# Altium schematic sheet 01_Power.SchDoc
size 513 x 386 mm
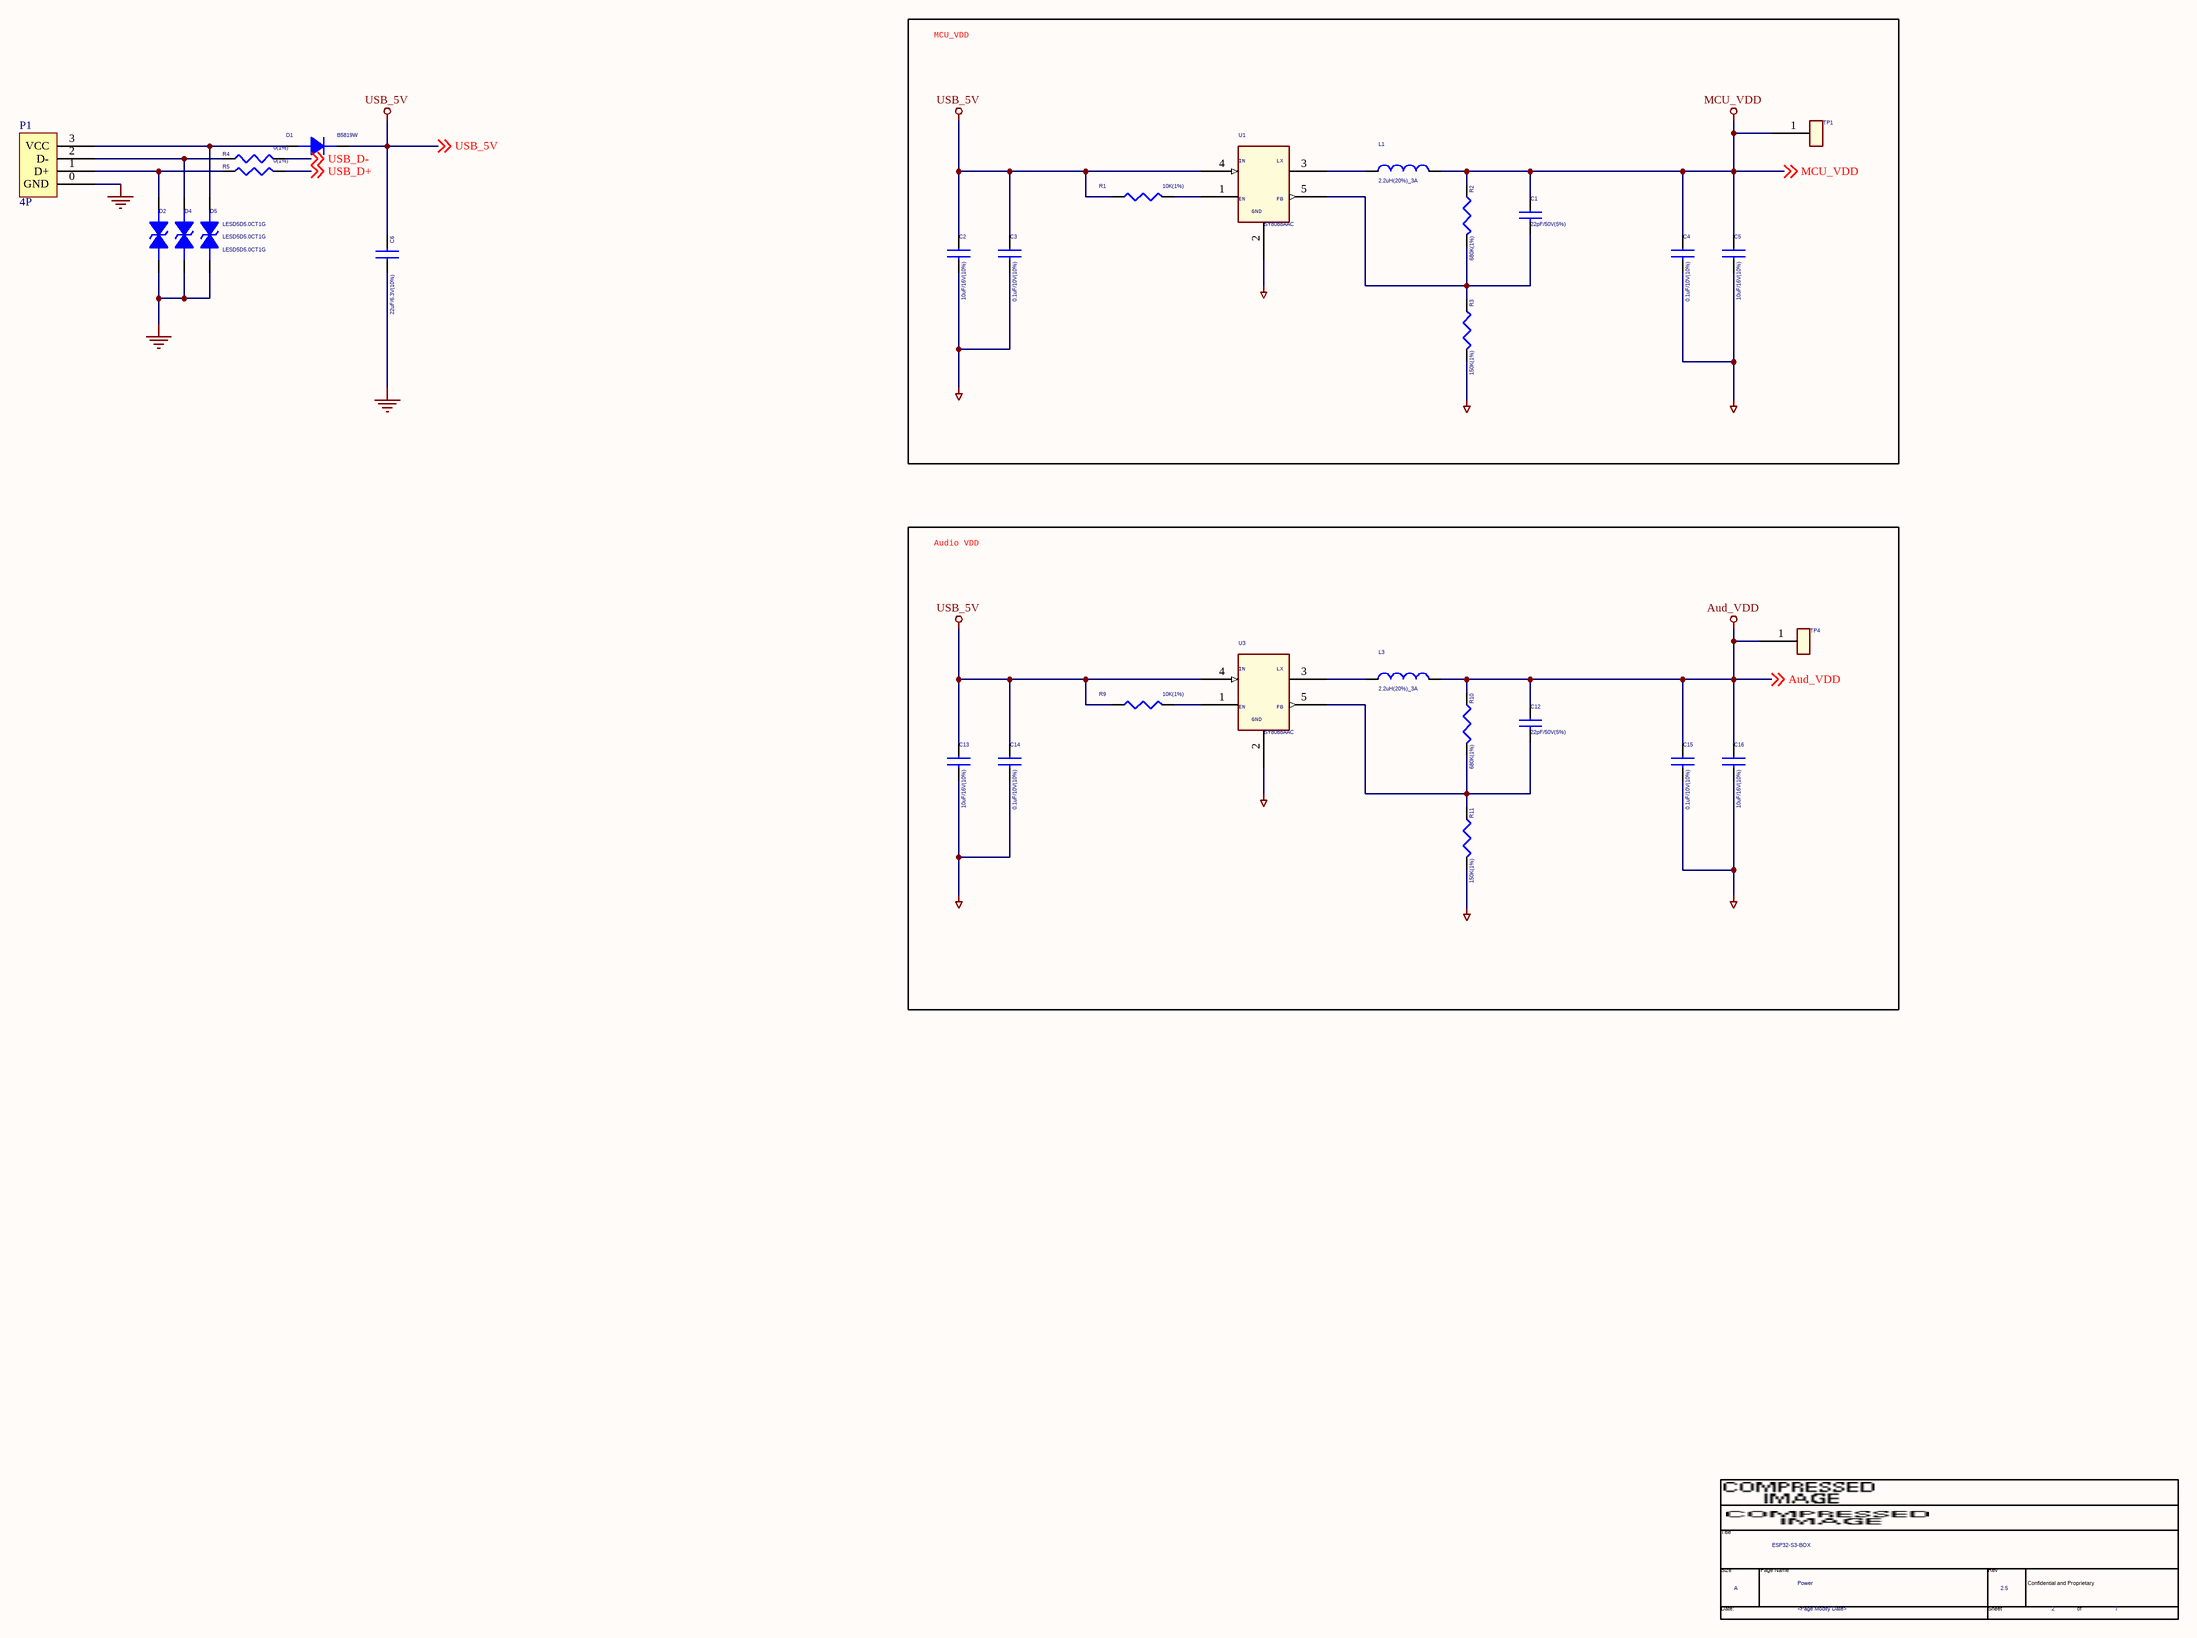
[diagram p0: 01_Power.SchDoc]

## Parts
*  Page Modify Date: <Page Modify Date>  Page Name: Power  Title: ESP32-S3-BOX  Page Size: A  Page Number: 2  Page Count: 7  RevCode: 2.5  (hidden comment: espTitleBlock3)  (graphical)
C1  22pF/50V(5%)  [0402_C]
C2  10uF/16V(10%)  [0603_C]
C3  0.1uF/10V(10%)  [0402_C]
C4  0.1uF/10V(10%)  [0402_C]
C5  10uF/16V(10%)  [0603_C]
C6  22uF/6.3V(10%)  [0603_C]
C12  22pF/50V(5%)  [0402_C]
C13  10uF/16V(10%)  [0603_C]
C14  0.1uF/10V(10%)  [0402_C]
C15  0.1uF/10V(10%)  [0402_C]
C16  10uF/16V(10%)  [0603_C]
D1  B5819W  [SOD-123]
D2  LESD5D5.0CT1G  [SOD-523]
D4  LESD5D5.0CT1G  [SOD-523]
D5  LESD5D5.0CT1G  [SOD-523]
L1  2.2uH(20%)_3A  [L4040]
L3  2.2uH(20%)_3A  [L4040]
P1  4P  [4P]
R1  10K(1%)  [0402_R]
R2  680K(1%)  [0402_R]
R3  150K(1%)  [0402_R]
R4  0(1%)  [0201_R]
R5  0(1%)  [0201_R]
R9  10K(1%)  [0402_R]
R10  680K(1%)  [0402_R]
R11  150K(1%)  [0402_R]
TP1  TESTPOINT  [TPC_D40]  (value not drawn)
TP4  TESTPOINT  [TPC_D40]  (value not drawn)
U1  SY8088AAC  [SOT-23-5]
U3  SY8088AAC  [SOT-23-5]

## Blocks framed on the sheet
MCU_VDD: C1-C5 L1 R1-R3 TP1 U1
Audio VDD: C12-C16 L3 R9-R11 TP4 U3

## Nets
Aud_VDD: C12.1 C15.1 C16.1 L3.2 R10.1 TP4.1 ; off-sheet Aud_VDD
GND: C2.2 C3.2 C4.2 C5.2 C6.1 C13.2 C14.2 C15.2 C16.2 D2.1 D4.1 D5.1 P1.0(GND) R3.2 R11.2 U1.2(GND) U3.2(GND)
MCU_VDD: C1.1 C4.1 C5.1 L1.2 R2.1 TP1.1 ; off-sheet MCU_VDD
USB_5V: C2.1 C3.1 C6.2 C13.1 C14.1 D1.2(K) R1.1 R9.1 U1.4(IN) U3.4(IN) ; off-sheet USB_5V
USB_D+: R5.2 ; off-sheet USB_D+
USB_D-: R4.2 ; off-sheet USB_D-
NetC1_2: C1.2 R2.2 R3.1 U1.5(FB)
NetC12_2: C12.2 R10.2 R11.1 U3.5(FB)
NetD1_1: D1.1(A) D5.2 P1.3(VCC)
NetD2_2: D2.2 P1.1(D+) R5.1
NetD4_2: D4.2 P1.2(D-) R4.1
NetL1_1: L1.1 U1.3(LX)
NetL3_1: L3.1 U3.3(LX)
NetR1_2: R1.2 U1.1(EN)
NetR9_2: R9.2 U3.1(EN)

## Notes on the sheet
- (in symbol espTitleBlock3) Title; Size; Page Name; Rev; Confidential and Proprietary; Date:; Sheet; of

## Library data of the parts
* = espTitleBlock3: Doc: ESP32-S3-EYE_V1.0; OrgName: ESPRESSIF
C1 C12 = CAPACITOR: Part Number: ES11041226520001; CODE12: ES11.04.122.6.5.2.00; Part Type: Capacitor
C2 C5 C13 C16 = CAPACITOR: Part Number: ES11067104600000; CODE12: ES11.06.710.4.6.0.00; Part Type: Capacitor
C3 C4 C14 C15 = CAPACITOR: Part Number: ES11045103620000; CODE12: ES11.04.510.3.6.2.00; Part Type: Capacitor
C6 = CAPACITOR: Part Number: ES11067222600001; CODE12: ES11.06.722.2.6.0.00; Part Type: Capacitor
D1 = DIODE_S: Part Number: ES31300150000000; CODE12: ES31.30.0020.00.0.0; Part Type: Diode
D2 D4 D5 = DIODE_BI_DIR: Part Number: ES31320020000000; CODE12: ES31.32.0020.00.0.0; Part Type: Diode
L1 L3 = INDUCTOR_Dup1
R1 R9 = RESISTOR: Part Number: ES21044100000001; CODE12: ES21.04.4100.0.00.0; Part Type: Resistor
R2 R10 = RESISTOR: Part Number: ES21045680000001; CODE12: ES21.04.5680.0.00.0; Part Type: Resistor
R3 R11 = RESISTOR: Part Number: ES21045150000001; CODE12: ES21.04.5150.0.00.0; Part Type: Resistor
R4 R5 = RESISTOR: Part Number: ES21020000000001; CODE12: ES21.02.0000.0.00.0; Part Type: Resistor
U1 U3 = SY808X: Part Number: ES41140401000000; CODE12: ES41.14.04.01.00.00; Part Type: Power ICs